# EAGLE design key20-ble (EAGLE 7.2.0)
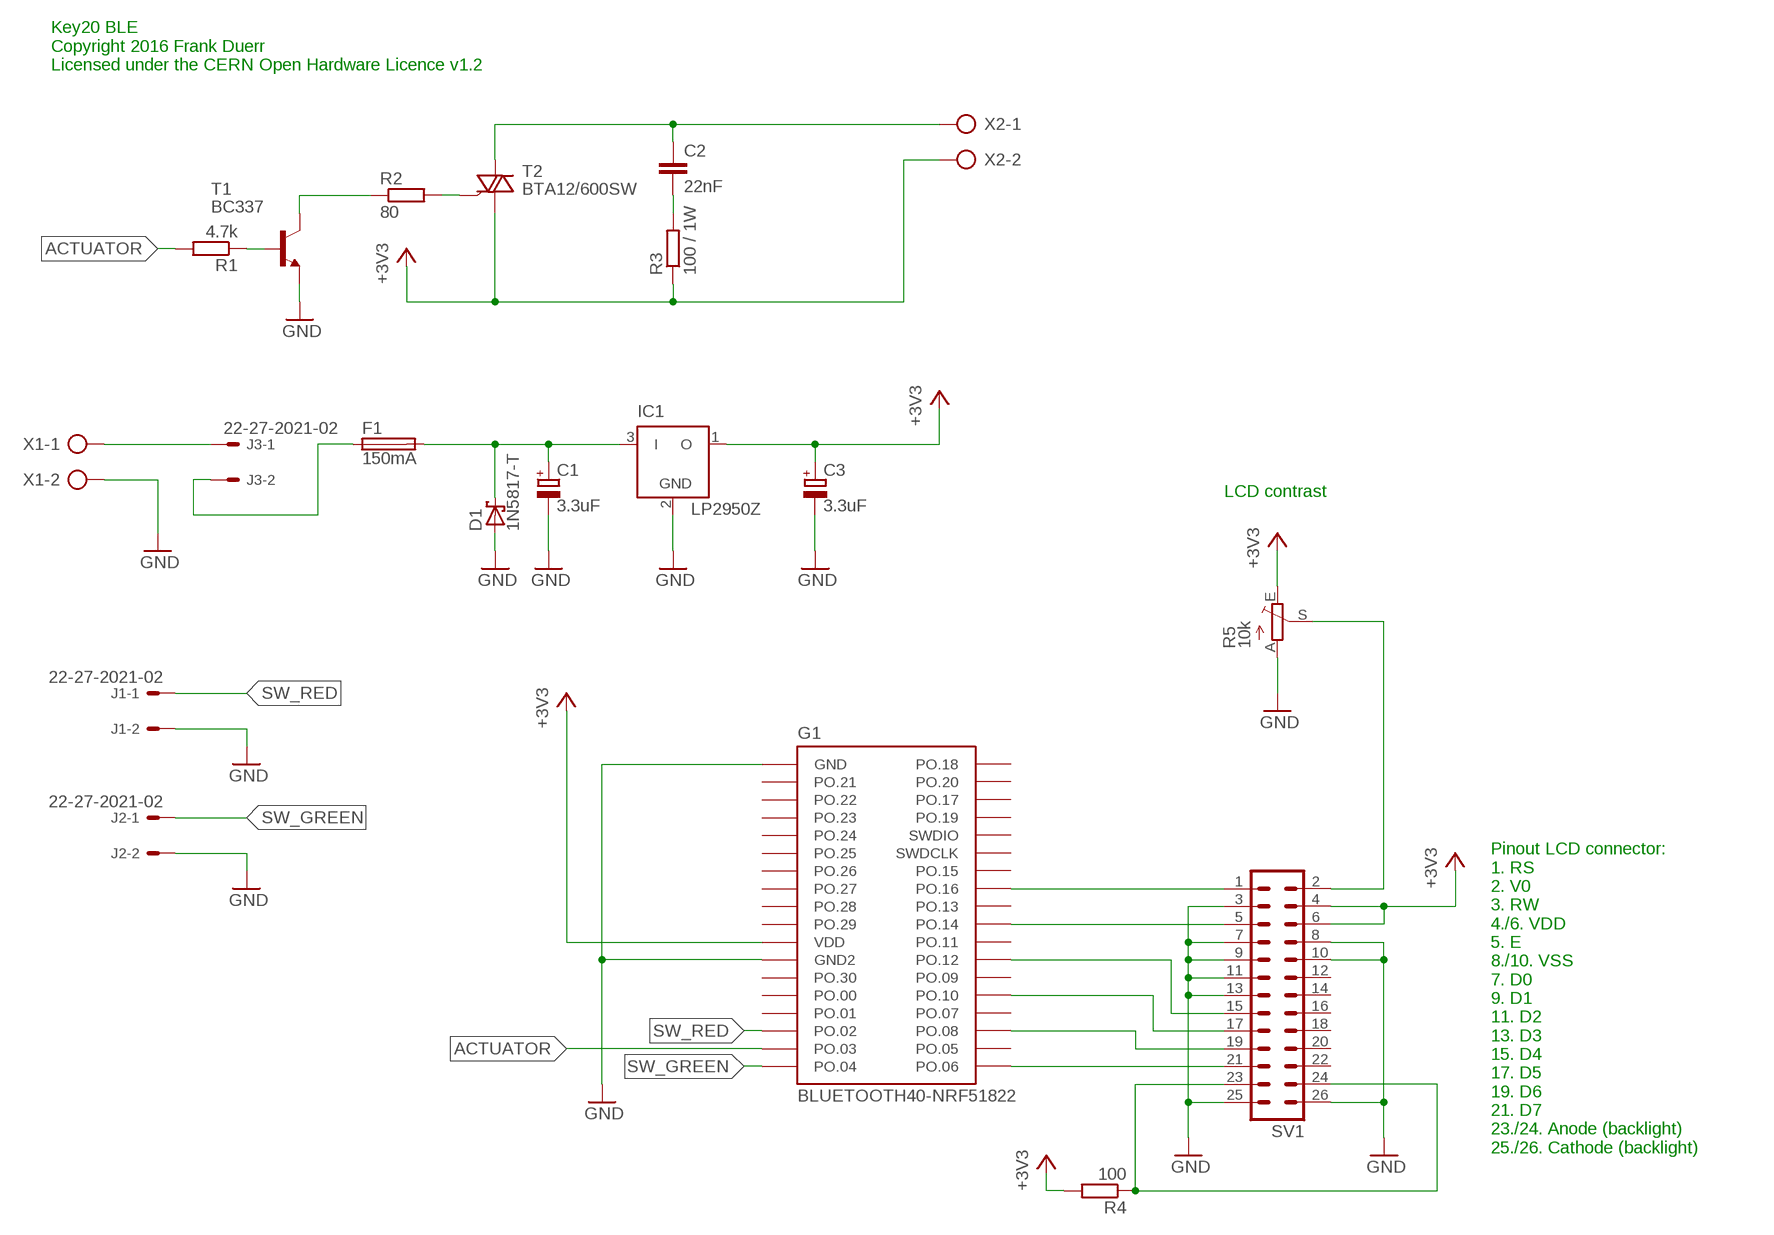
[diagram p0: schematic, sheet 1]

## Parts
C1  3.3uF  CPOL-EUE2.5-5  [E2,5-5]
C2  22nF  C-EU102-054X133  [C102-054X133]
C3  3.3uF  CPOL-EUE2.5-5  [E2,5-5]
D1  1N5817-T  [DO41-7.6]
F1  150mA  FUSESH22,5  [SH22,5]
G1  BLUETOOTH40-NRF51822  [BLUETOOTH40-NR51822]
IC1  LP2950Z  [TO92]
J1  22-27-2021-02  [6410-02]
J2  22-27-2021-02  [6410-02]
J3  22-27-2021-02  [6410-02]
R1  4.7k  R-EU_0207/7  [0207/7]
R2  80  R-EU_0207/7  [0207/7]
R3  100 / 1W  R-EU_0207/7  [0207/7]
R4  100  R-EU_0207/7  [0207/7]
R5  10k  TRIM_EU-CA6V  [CA6V]
SV1  ML26  [ML26]
T1  BC337  [TO92]
T2  BTA12/600SW  TIC206M  [TO220BV]
X1  AK500/2  [AK500/2]
X2  AK500/2  [AK500/2]

## Nets
+3V3: C3.+ G1.VDD IC1.1(O) R3.1 R4.2 R5.E SV1.4 SV1.6 T2.T1(A1) X2.2
ACTUATOR: G1.PO.03 R1.2
GND: C1.- C3.- D1.A G1.GND G1.GND2 IC1.2(GND) J1.2 J2.2 R5.A SV1.3 SV1.7 SV1.8 SV1.9 SV1.10 SV1.11 SV1.13 SV1.25 SV1.26 T1.1(E) X1.2
N$1: R2.2 T2.G
N$2: C2.2 R3.2
N$3: C2.1 T2.T2(A2) X2.1
N$4: R1.1 T1.2(B)
N$5: R2.1 T1.3(C)
N$6: G1.PO.08 SV1.19
N$7: F1.1 J3.2
N$9: G1.PO.06 SV1.21
N$12: G1.PO.14 SV1.5
N$13: G1.PO.16 SV1.1
N$14: R5.S SV1.2
N$15: R4.1 SV1.23 SV1.24
N$16: J3.1 X1.1
N$17: C1.+ D1.C F1.2 IC1.3(I)
N$18: G1.PO.10 SV1.17
N$19: G1.PO.12 SV1.15
SW_GREEN: G1.PO.04 J2.1
SW_RED: G1.PO.02 J1.1
Unconnected: G1.PO.00 G1.PO.01 G1.PO.05 G1.PO.07 G1.PO.09 G1.PO.11 G1.PO.13 G1.PO.15 G1.PO.17 G1.PO.18 G1.PO.19 G1.PO.20 G1.PO.21 G1.PO.22 G1.PO.23 G1.PO.24 G1.PO.25 G1.PO.26 G1.PO.27 G1.PO.28 G1.PO.29 G1.PO.30 G1.SWDCLK G1.SWDIO SV1.12 SV1.14 SV1.16 SV1.18 SV1.20 SV1.22

## Notes on the sheet
- Key20 BLE
  Copyright 2016 Frank Duerr
  Licensed under the CERN Open Hardware Licence v1.2
- LCD contrast
- Pinout LCD connector:
  1. RS
  2. V0
  3. RW
  4./6. VDD
  5. E
  8./10. VSS
  7. D0
  9. D1
  11. D2
  13. D3
  15. D4
  17. D5
  19. D6
  21. D7
  23./24. Anode (backlight)
  25./26. Cathode (backlight)

## Library data of the parts
C1 C3 = rcl:CPOL-EU: POLARIZED CAPACITOR, European symbol
C2 = rcl:C-EU: CAPACITOR, European symbol
D1 = diode:1N581*: 1.0A SCHOTTKY BARRIER RECTIFIER Source: http://www.diodes.com/datasheets/ds23001.pdf
F1 = fuse:FUSE: Fuse; OC_FARNELL: unknown; OC_NEWARK: unknown
G1 = bluetooth40-nrf51822:BLUETOOTH40-NRF51822
IC1 = linear:LP2950: 100 mA, Low Power Low Dropout Voltage Regulator Source: http://www.onsemi.com/pub/Collateral/LP2950-D.PDF
J1-J3 = con-molex:22-?-02: CONNECTOR wire to board 2.54 mm (.1 inch) pitch header; OC_FARNELL: unknown; OC_NEWARK: unknown
R1-R4 = rcl:R-EU_: RESISTOR, European symbol
R5 = pot:TRIM_EU-: POTENTIOMETER
SV1 = con-harting-ml:ML26: HARTING; OC_FARNELL: unknown; OC_NEWARK: unknown
T1 = transistor:BC337: NPN TRANSISTOR
T2 = triac:TIC206: TRIAC Source: http://www.bourns.com/pdfs/tic206.pdf
X1 X2 = con-ptr500:AK500/2: CONNECTOR; OC_FARNELL: unknown; OC_NEWARK: unknown

## Board
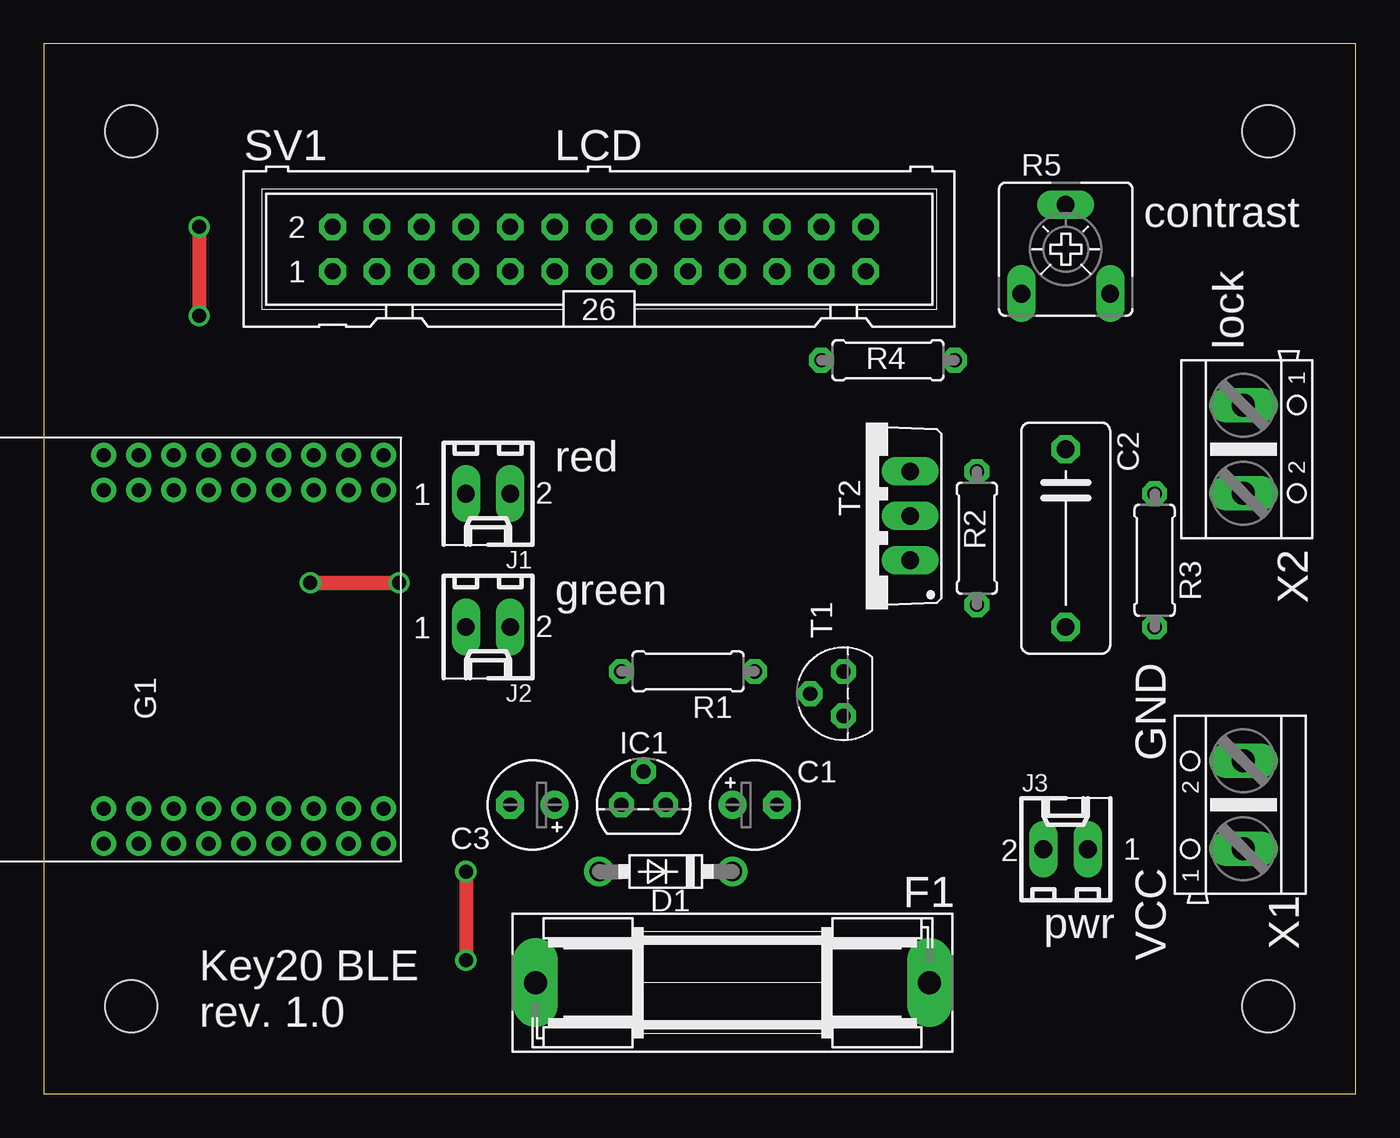
[diagram p1: board, top side]
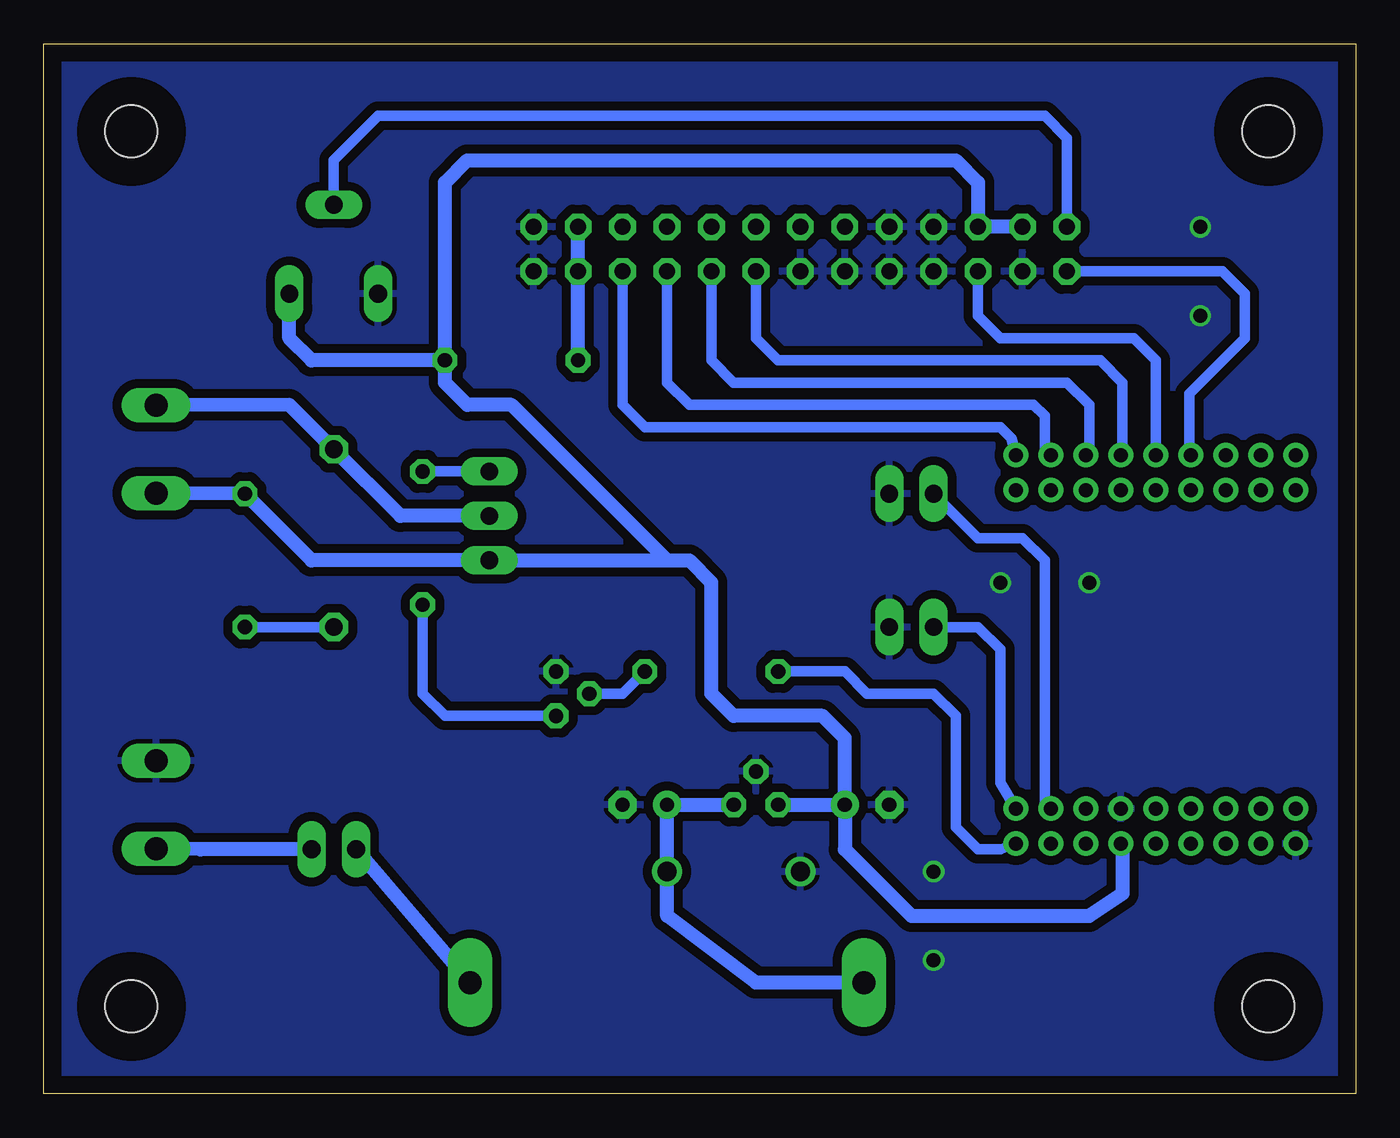
[diagram p2: board, bottom side, seen from below]

Size 75 x 60 mm. Coordinates in mm from the lower left corner, seen from the top.
Outline: 0,0 75,0 75,60 0,60 0,0
Copper layers (1*16): Top 0.035mm / dielectric 1.5mm / Bottom 0.035mm
Design rules "default *": minimum track width 10mil, minimum drill 24mil, track to track 20mil, track to pad 20mil, pad to pad 20mil, via to via 20mil, smd to smd 8mil, copper to edge 40mil, drill to drill 8mil, minimum pad ring 12mil, minimum via ring 8mil, stop-mask expansion 4mil, vias tented up to drill 0mil, thermal gap 10mil
Holes 3 mm at 5,5 5,55 70,5 70,55
bRestrict: area 1.9,1.9 to 8.1,8.1; area 1.9,51.9 to 8.1,58.1; area 66.9,51.9 to 73.1,58.1; area 66.9,1.9 to 73.1,8.1

### Footprints (pad centres in the part's own frame; a part is rotated, then mirrored left to right if it is on the bottom)
E2,5-5 = drill 0.813 pad 1.6: + -1.27,0 | drill 0.813 pad 1.6 octagon: - 1.27,0
C102-054X133 = drill 1.016 octagon: 1 -5.08,0; 2 5.08,0
DO41-7.6 = drill 1.1 pad 1.7: A 3.81,0; C -3.81,0
SH22,5 = drill 1.321 pad 2.54 long: 1 -11.252,0; 2 11.252,0
BLUETOOTH40-NR51822 = drill 0.8: GND -11.1,8; GND2 -9.1,-2; PO.00 -9.1,-4; PO.01 -11.1,-6; PO.02 -9.1,-6; PO.03 -11.1,-8; PO.04 -9.1,-8; PO.05 9.1,-8; PO.06 11.1,-8; PO.07 9.1,-6; PO.08 11.1,-6; PO.09 9.1,-4; PO.10 11.1,-4; PO.11 9.1,-2; PO.12 11.1,-2; PO.13 9.1,0; PO.14 11.1,0; PO.15 9.1,2; PO.16 11.1,2; PO.17 9.1,6; PO.18 9.1,8; PO.19 11.1,6; PO.20 11.1,8; PO.21 -9.1,8; PO.22 -11.1,6; PO.23 -9.1,6; PO.24 -11.1,4; PO.25 -9.1,4; PO.26 -11.1,2; PO.27 -9.1,2; PO.28 -11.1,0; PO.29 -9.1,0; PO.30 -11.1,-4; SWDCLK 11.1,4; SWDIO 9.1,4; VDD -11.1,-2
TO92 = drill 0.813 octagon: 1 -1.27,0; 2 0,1.905; 3 1.27,0
6410-02 = drill 1.016 long: 1 1.27,0; 2 -1.27,0
0207/7 = drill 0.813 octagon: 1 -3.81,0; 2 3.81,0
CA6V = drill 1.016 long: A -2.54,-2.54; E 2.54,-2.54; S 0,2.54
ML26 = drill 0.914 octagon: 1 -15.24,-1.27; 2 -15.24,1.27; 3 -12.7,-1.27; 4 -12.7,1.27; 5 -10.16,-1.27; 6 -10.16,1.27; 7 -7.62,-1.27; 8 -7.62,1.27; 9 -5.08,-1.27; 10 -5.08,1.27; 11 -2.54,-1.27; 12 -2.54,1.27; 13 0,-1.27; 14 0,1.27; 15 2.54,-1.27; 16 2.54,1.27; 17 5.08,-1.27; 18 5.08,1.27; 19 7.62,-1.27; 20 7.62,1.27; 21 10.16,-1.27; 22 10.16,1.27; 23 12.7,-1.27; 24 12.7,1.27; 25 15.24,-1.27; 26 15.24,1.27
TO92' = drill 0.813 octagon: 1 1.27,0; 2 0,1.905; 3 -1.27,0
TO220BV = drill 1.016 long: G 2.54,-2.54; T1 -2.54,-2.54; T2 0,-2.54
AK500/2 = drill 1.321 long: 1 -2.515,0; 2 2.515,0

### Placement (x,y rotation side)
C1  40.64,16.51 0 top
C2  58.42,31.75 270 top
C3  27.94,16.51 180 top
D1  35.56,12.7 180 top
F1  39.37,6.35 180 top
G1  11.43,25.4 90 top
IC1  34.29,16.51 0 top
J1  25.4,34.29 180 top
J2  25.4,26.67 180 top
J3  58.42,13.97 0 top
R1  36.83,24.13 180 top
R2  53.34,31.75 90 top
R3  63.5,30.48 270 top
R4  48.26,41.91 0 top
R5  58.42,48.26 0 top
SV1  31.75,48.26 0 top
T1  BC337  [TO92']  45.72,22.86 90 top
T2  46.99,33.02 90 top
X1  68.58,16.51 90 top
X2  68.58,36.83 270 top

### Tracks (layer width: path | path; a pad name or v marks a point on that pad's centre or on a via)
+3V3
  Bottom 0.61: G1.VDD 13.34,13.97
  Bottom 0.813: IC1.1 C3.+ | C3.+ 29.21,13.97 25.4,10.16 15.24,10.16 13.34,11.43 13.34,13.97 | R4.2 52.07,40.64 50.8,39.37 48.26,39.37 39.37,30.48 | C3.+ 29.21,20.32 30.48,21.59 35.56,21.59 36.83,22.86 36.83,29.21 38.1,30.48 39.37,30.48 | X2.2 R3.1 59.69,30.48 T2.T1 39.37,30.48 | R4.2 52.07,52.07 50.8,53.34 22.86,53.34 21.59,52.07 SV1.6 SV1.4 | R4.2 59.69,41.91 60.96,43.18 R5.E
ACTUATOR
  Bottom 0.61: G1.PO.03 20.32,13.97 21.59,13.97 22.86,15.24 22.86,21.59 24.13,22.86 27.94,22.86 29.21,24.13 R1.2
GND  (via drill 0.8)
  Top 0.813: v8.89,49.53 v8.89,44.45 | v24.13,12.7 v24.13,7.62 | v15.24,29.21 v20.32,29.21
  pour Bottom: -2.54,60.96 76.2,60.96 76.2,-2.54 -2.54,-2.54
N$1
  Bottom 0.61: R2.2 T2.G
N$2
  Bottom 0.61: R3.2 C2.2
N$3
  Bottom 0.813: T2.T2 54.61,33.02 C2.1 60.96,39.37 X2.1
N$4
  Bottom 0.61: R1.1 41.91,22.86 T1.2
N$5
  Bottom 0.61: T1.3 52.07,21.59 53.34,22.86 R2.1
N$6
  Bottom 0.61: SV1.19 39.37,40.64 38.1,39.37 18.41,39.37 17.78,38.73 17.78,36.83 G1.PO.08
N$7
  Bottom 0.813: J3.2 F1.1
N$9
  Bottom 0.61: SV1.21 41.91,39.37 40.64,38.1 20.32,38.1 19.68,37.47 G1.PO.06
N$12
  Bottom 0.61: SV1.5 21.59,44.45 20.32,43.18 12.7,43.18 11.43,41.91 G1.PO.14
N$13
  Bottom 0.61: G1.PO.16 9.53,36.83 9.53,40.01 6.35,43.18 6.35,45.72 7.62,46.99 SV1.1
N$14
  Bottom 0.61: R5.S 58.42,53.34 55.88,55.88 17.78,55.88 16.51,54.61 SV1.2
N$15
  Bottom 0.813: R4.1 SV1.23 SV1.24
N$16
  Bottom 0.813: J3.1 66.04,13.97 X1.1
N$17
  Bottom 0.813: IC1.3 C1.+ D1.C 39.37,10.16 34.29,6.35 F1.2 27.94,6.35
N$18
  Bottom 0.61: SV1.17 36.83,41.91 35.56,40.64 16.51,40.64 15.24,39.37 15.24,36.83 G1.PO.10
N$19
  Bottom 0.61: SV1.15 34.29,43.18 33.02,41.91 14.61,41.91 13.34,40.64 13.34,36.83 G1.PO.12
SW_GREEN
  Bottom 0.61: G1.PO.04 20.32,17.78 20.32,25.4 21.59,26.67 J2.1
SW_RED
  Bottom 0.61: G1.PO.02 17.78,16.3 17.78,30.48 19.05,31.75 21.59,31.75 J1.1

### Text on the board
tPlace: LCD | contrast | lock | red | green | GND | pwr | VCC | Key20 BLE / rev. 1.0
Document: Key20 BLE / Copyright 2016 Frank Duerr / Licensed under the CERN Open Hardware Licence v1.2